# EAGLE design brick_i2c_lsm9ds1 (EAGLE 7.2.0)
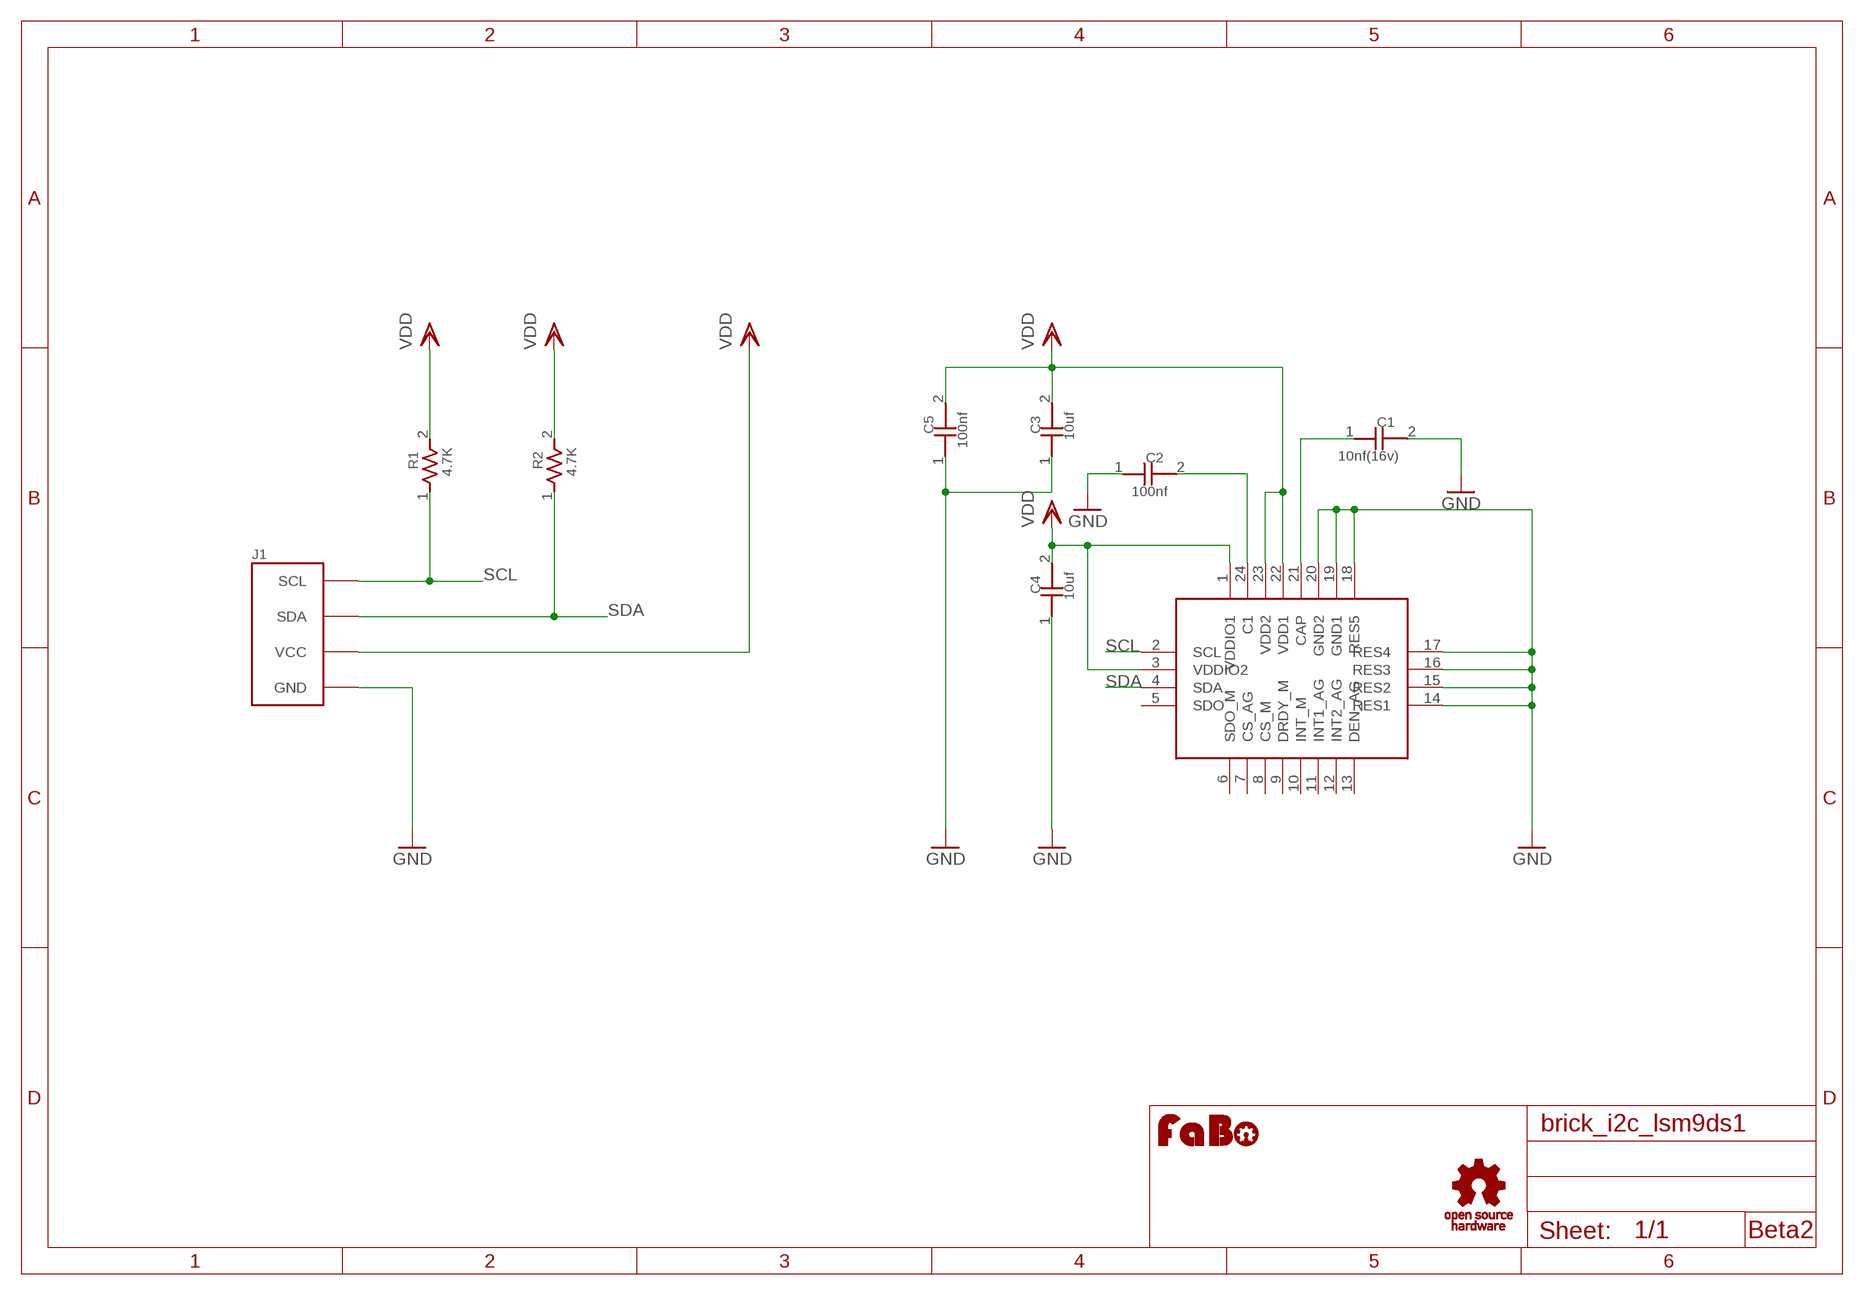
[diagram p0: schematic, sheet 1]

## Parts
C1  10nf(16v)  CAPACITOR0603  [0603]
C2  100nf  CAPACITOR0603  [0603]
C3  10uf  CAPACITOR0603  [0603]
C4  10uf  CAPACITOR0603  [0603]
C5  100nf  CAPACITOR0603  [0603]
J1  BRICK_I2C  [BRICK_I2C]
R1  4.7K  RESISTOR0603  [0603]
R2  4.7K  RESISTOR0603  [0603]
U$1  ST-LSM9DS1TR  [ST-LSM9DS1TR]
U$3  LOGO_OSHW_T-M  [LOGO_OSHW_T_M]
U$4  LOGO_FABO-M  [LOGO_FABO_M]

## Nets
GND: C1.2 C2.1 C3.1 C4.1 C5.1 J1.GND U$1.14(RES1) U$1.15(RES2) U$1.16(RES3) U$1.17(RES4) U$1.18(RES5) U$1.19(GND1) U$1.20(GND2)
N$1: C1.1 U$1.21(CAP)
N$6: C2.2 U$1.24(C1)
SCL: J1.SCL R1.1 U$1.2(SCL)
SDA: J1.SDA R2.1 U$1.4(SDA)
VDD: C3.2 C4.2 C5.2 J1.VCC R1.2 R2.2 U$1.1(VDDIO1) U$1.3(VDDIO2) U$1.22(VDD1) U$1.23(VDD2)
Unconnected: U$1.5(SDO) U$1.6(SDO_M) U$1.7(CS_AG) U$1.8(CS_M) U$1.9(DRDY_M) U$1.10(INT_M) U$1.11(INT1_AG) U$1.12(INT2_AG) U$1.13(DEN_AG)

## Notes on the sheet
- Beta2

## Library data of the parts
C1-C5 = GClue-Capacitor:CAPACITOR
J1 = gclue:BRICK_I2C: FaBo Brick 4pin(I2C)
R1 R2 = GClue-Resistors:RESISTOR
U$1 = GClue-Mems:ST-LSM9DS1TR
U$3 = gclue:LOGO_OSHW_T
U$4 = FaBo:LOGO_FABO

## Board
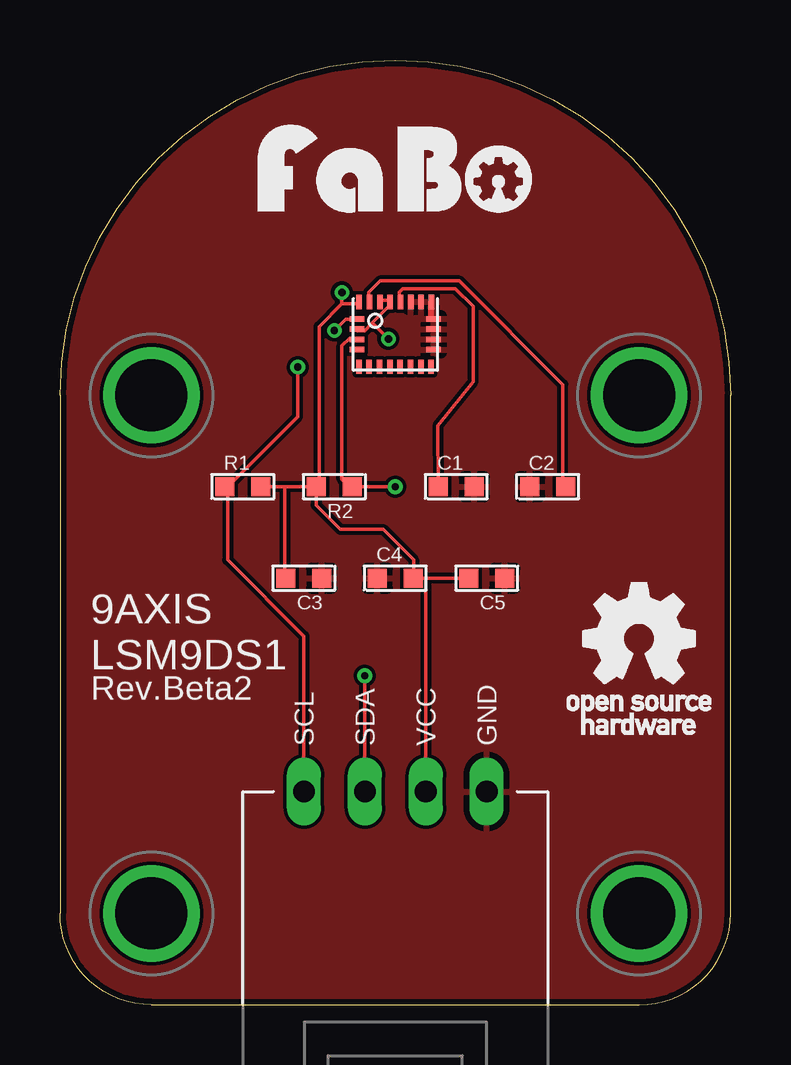
[diagram p1: board, top side]
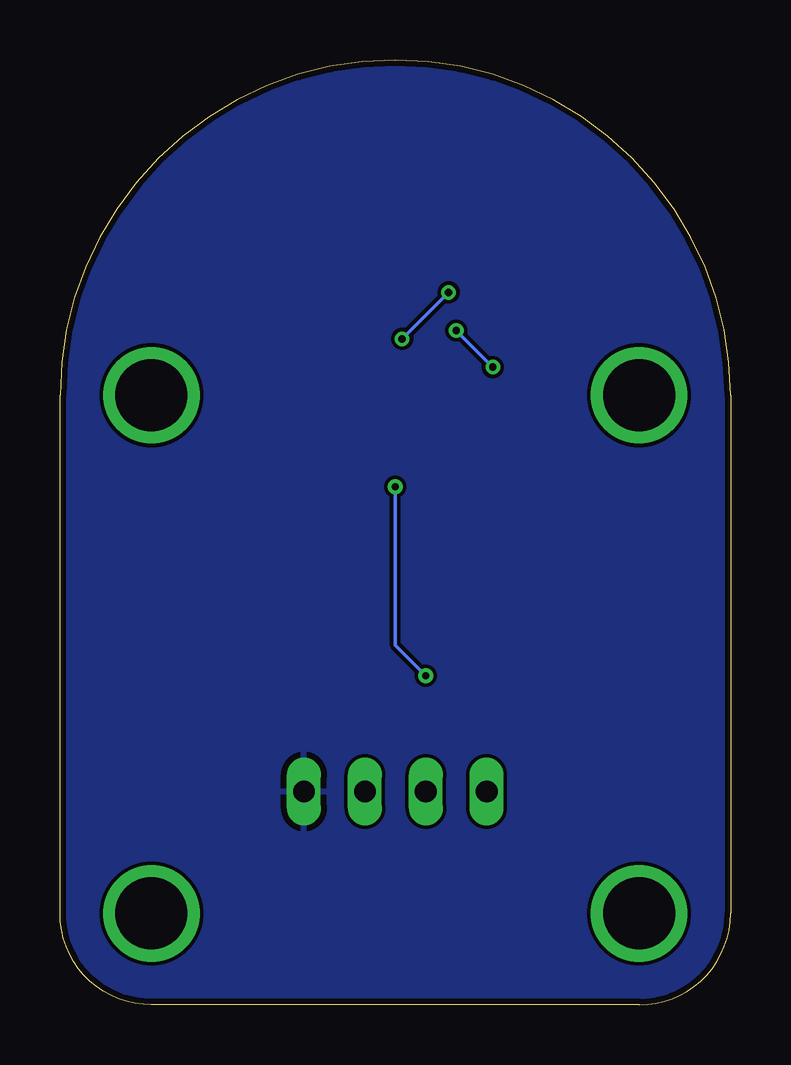
[diagram p2: board, bottom side, seen from below]

Size 27.94 x 39.37 mm. Coordinates in mm from the lower left corner, seen from the top.
Copper layers (1*16): Top 0.035mm / dielectric 1.5mm / Bottom 0.035mm
Design rules "Elecrow_2-layer_eagle_rule": minimum track width 6mil, minimum drill 12mil, track to track 6mil, track to pad 6mil, pad to pad 6mil, via to via 6mil, smd to smd 0mil, copper to edge 10mil, drill to drill 10mil, minimum pad ring 10mil, minimum via ring 6mil, stop-mask expansion 2mil, vias tented up to drill 100mil, thermal gap 10mil

### Footprints (pad centres in the part's own frame; a part is rotated, then mirrored left to right if it is on the bottom)
0603 = smd 0.8 x 0.8: 1 -0.75,0; 2 0.75,0
BRICK_I2C = drill 0.9 long: GND 3.81,-10.16; SCL -3.81,-10.16; SDA -1.27,-10.16; VCC 1.27,-10.16 | drill 3 pad 3.81: P$1 -10.16,6.35; P$2 10.16,6.35; P$3 -10.16,-15.24; P$4 10.16,-15.24
ST-LSM9DS1TR = smd 0.23 x 0.6: 1 -1.505,1.35; 6 -1.517,-1.35; 7 -1.087,-1.35; 8 -0.657,-1.35; 9 -0.227,-1.35; 10 0.203,-1.35; 11 0.633,-1.35; 12 1.063,-1.35; 13 1.493,-1.35; 18 1.505,1.35; 19 1.075,1.35; 20 0.645,1.35; 21 0.215,1.35; 22 -0.215,1.35; 23 -0.645,1.35; 24 -1.075,1.35 | smd 0.6 x 0.23: 2 -1.6,0.648; 3 -1.6,0.218; 4 -1.6,-0.212; 5 -1.6,-0.642; 14 1.6,-0.642; 15 1.6,-0.212; 16 1.6,0.218; 17 1.6,0.648

### Placement (x,y rotation side)
C1  16.51,21.59 0 top
C2  20.32,21.59 0 top
C3  10.16,17.78 180 top
C4  13.97,17.78 0 top
C5  17.78,17.78 180 top
J1  13.97,19.05 0 top
R1  7.62,21.59 0 top
R2  11.43,21.59 180 top
U$1  13.97,27.94 0 top
U$3  24.13,15.24 0 top
U$4  13.97,33.02 0 top

### Tracks (layer width: path | path; a pad name or v marks a point on that pad's centre or on a via)
GND
  Top 0.152: U$1.14 15.56,27.3 U$1.14
  Top 0.254: U$1.17 15.47,28.59 U$1.18
  pour Bottom: -1.27,-1.27 29.21,-1.27 29.21,40.64 -1.27,40.64
  pour Top: -1.27,-1.27 29.21,-1.27 29.21,40.64 -1.27,40.64
N$1
  Top 0.152: U$1.21 14.13,29.37 14.13,29.69 14.29,29.84 16.48,29.84 17.21,29.11 17.21,25.97 15.75,24.13 C1.1
N$6
  Top 0.152: U$1.24 12.86,29.37 12.86,29.69 13.34,30.16 16.64,30.16 20.95,25.84 20.95,21.59 C2.2
SCL  (via drill 0.3)
  Top 0.152: v11.43,28.1 11.91,28.57 12.22,28.57 U$1.2 | v9.91,26.57 9.91,24.51 6.99,21.59 | J1.SCL 10.16,15.37 6.99,18.54 6.99,21.59 | 6.99,21.59 R1.1
  Bottom 0.152: v9.91,26.57 v11.43,28.1
SDA  (via drill 0.3)
  Top 0.152: U$1.4 12.22,27.78 12.06,27.78 11.75,27.46 11.75,21.91 12.06,21.59 R2.1 v13.97,21.59 | J1.SDA v12.7,13.72
  Bottom 0.152: v13.97,21.59 13.97,14.99 v12.7,13.72
VDD  (via drill 0.3)
  Top 0.152: C5.2 15.24,17.78 | 15.24,17.78 C4.2 14.73,18.03 14.73,18.54 13.46,19.81 11.68,19.81 10.67,20.83 10.67,21.34 10.79,21.59 | 13.02,28.42 13.81,29.21 U$1.22 13.65,29.37 13.34,29.37 U$1.23 | 13.02,28.42 12.7,28.1 12.38,28.1 U$1.3 | 11.75,29.21 12.38,29.21 U$1.1 | 11.75,29.21 10.79,28.26 10.79,21.59 | 9.37,21.59 R2.2 10.79,21.59 | 9.37,21.59 R1.2 | 9.37,21.59 9.37,17.78 C3.2 | v13.68,27.75 13.02,28.42 | 11.75,29.21 v11.75,29.69 | 15.24,17.78 J1.VCC
  Bottom 0.152: v11.75,29.69 v13.68,27.75

### Text on the board
tPlace: 9AXIS / LSM9DS1 | Rev.Beta2